# EasyEDA Pro project WEN-OP-AD8367可变增益放大器.epro

# Schematic Schematic2
Board Name: WEN-OP-AD8367可变增益放大器; Create Date: 2025-03-23; Page Name: P1; Project Name: 2025电赛预制模块mmkk; Schematic Name: Schematic2; Update Date: 2025-03-24; Company: 嘉立创EDA; Page Size: A1; Version: V1.0
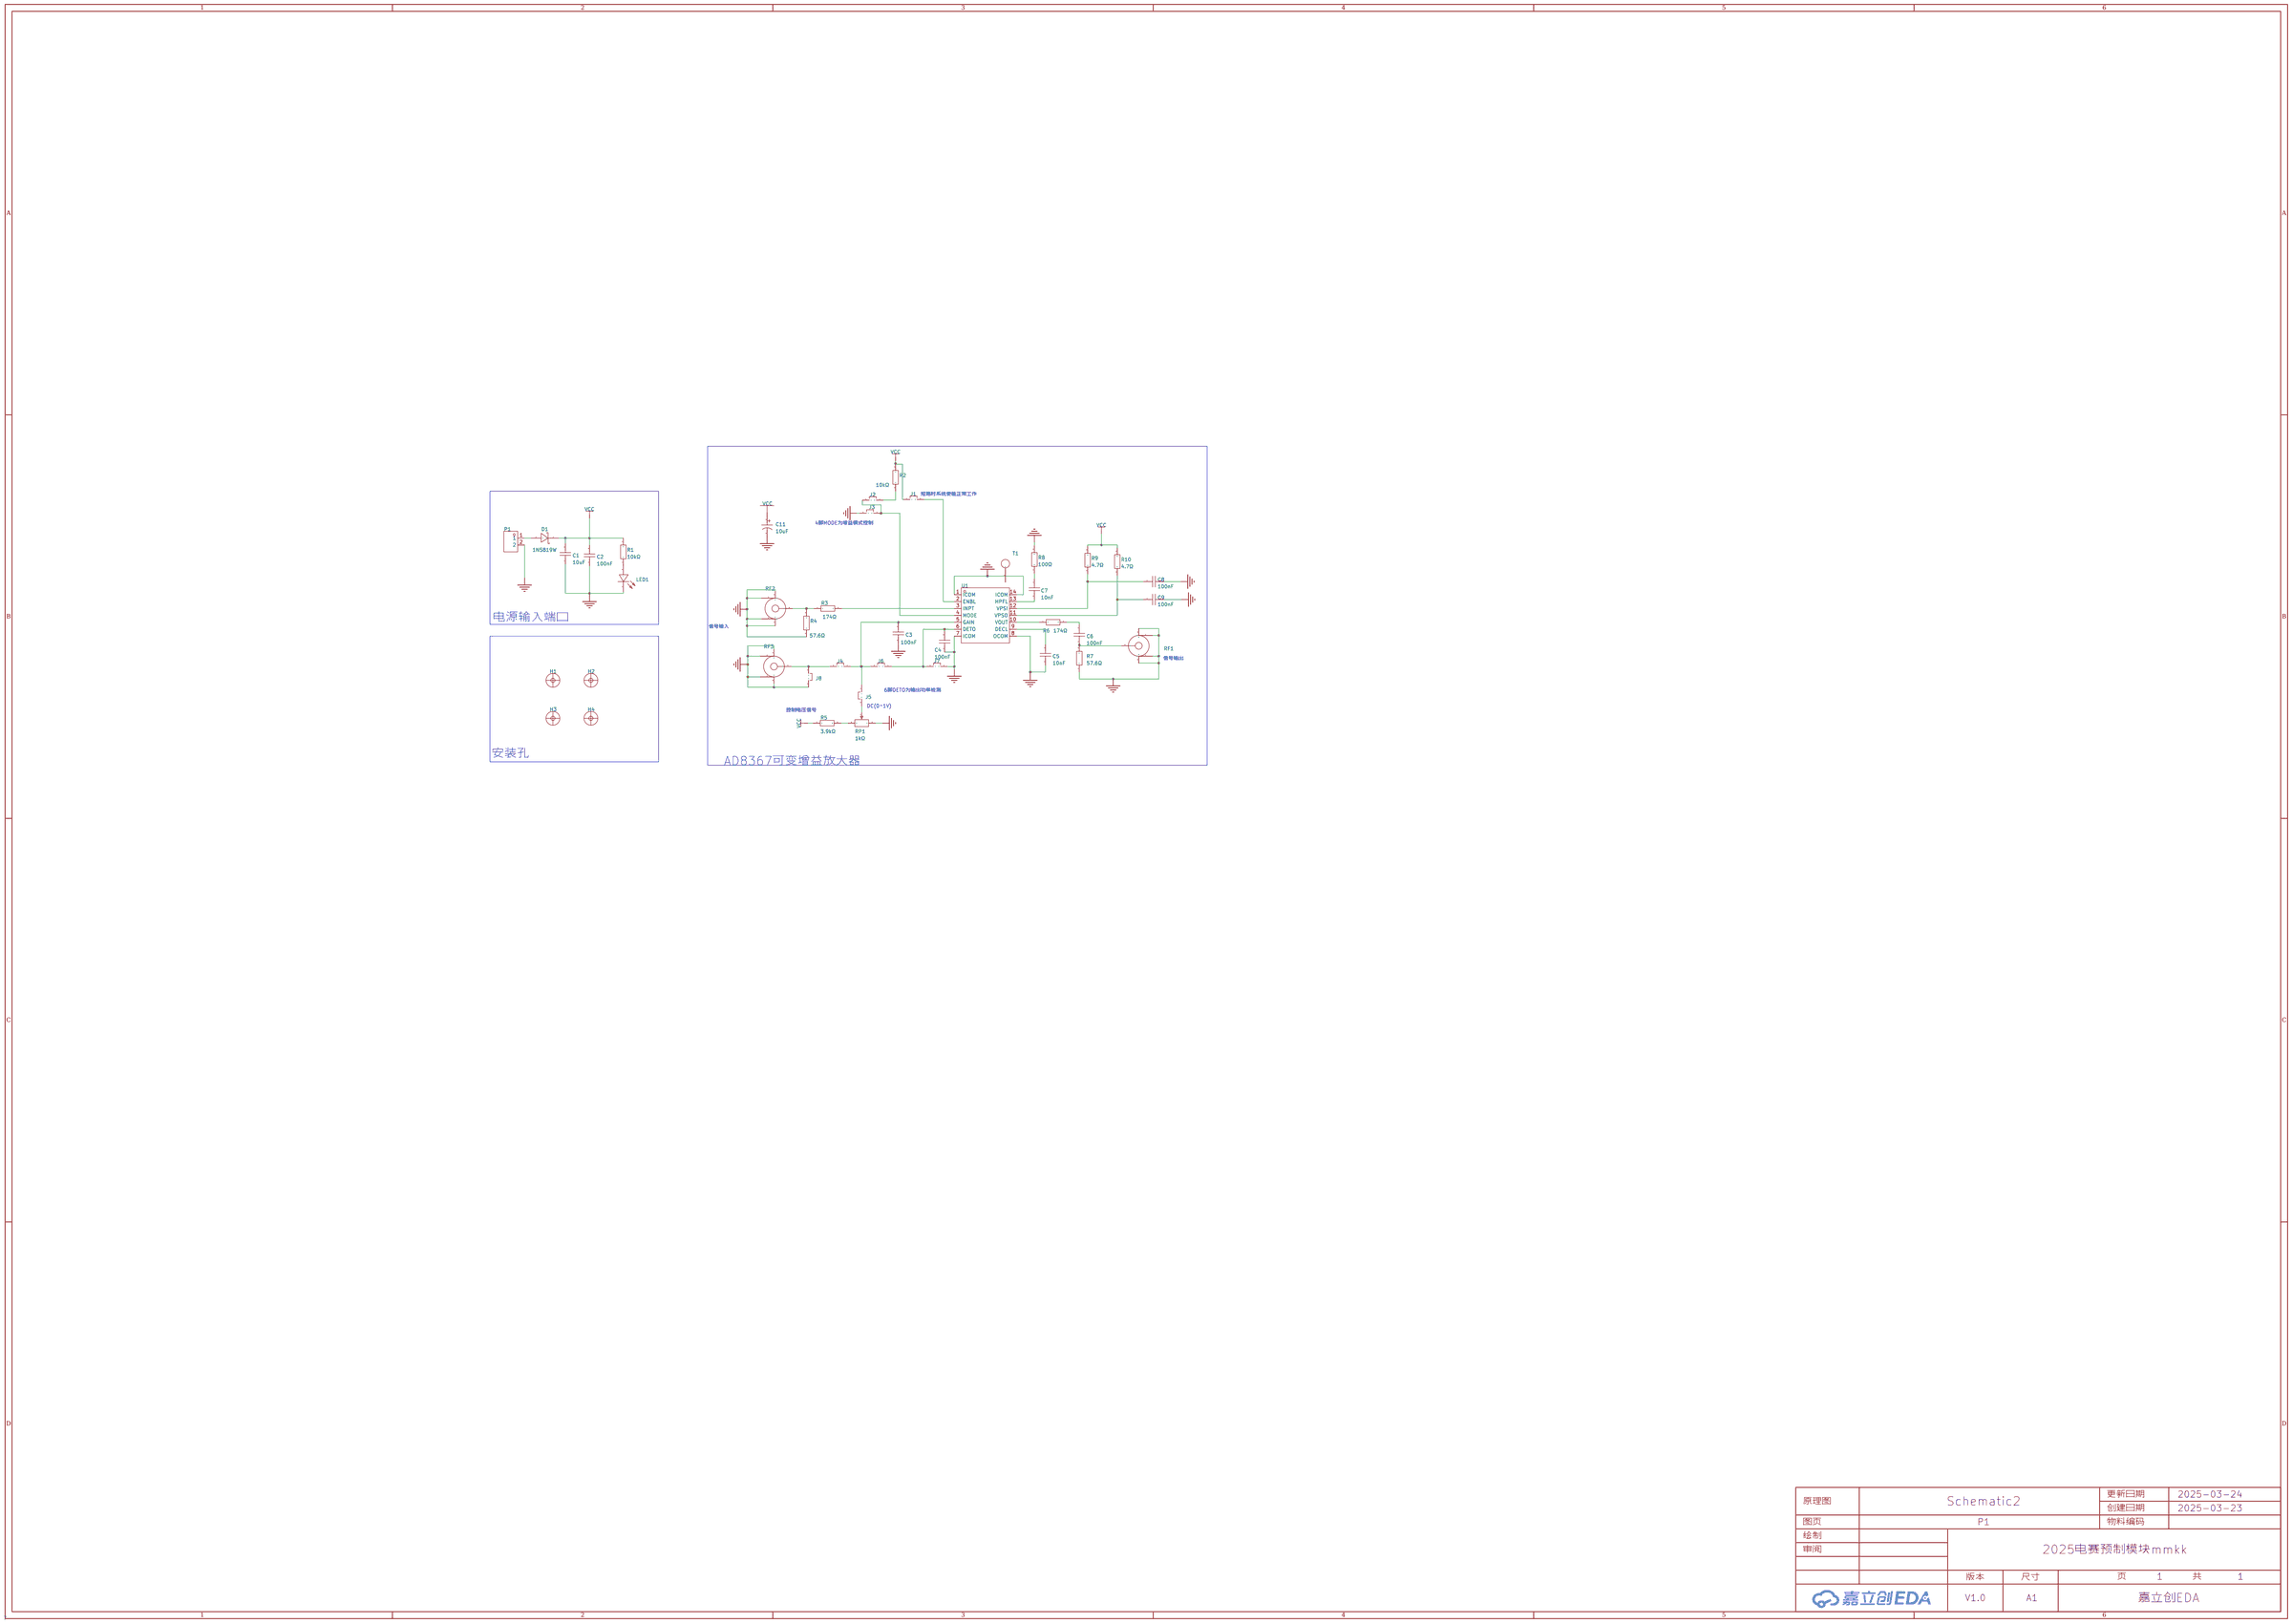
[diagram p0: schematic sheet]

## Parts
C1  10uF  [C0805]
C2  100nF  [C0805]
C3  100nF  [C0805]
C4  100nF  [C0805]
C5  10nF  [C0805]
C6  100nF  [C0805]
C7  10nF  [C0805]
C8  100nF  [C0805]
C9  100nF  [C0805]
C11  10uF  [CAP-SMD_BD4.0-L4.3-W4.3-FD]
D1  1N5819W  [SOD-323F_L2.5-W1.3-RD]
H1  -  [M3]
H2  -  [M3]
H3  -  [M3]
H4  -  [M3]
J1  PZ254V-11-02P  [HDR-TH_2P-P2.54-V-M]
J2  PZ254V-11-02P  [HDR-TH_2P-P2.54-V-M]
J3  PZ254V-11-02P  [HDR-TH_2P-P2.54-V-M]
J4  PZ254V-11-02P  [HDR-TH_2P-P2.54-V-M]
J5  PZ254V-11-02P  [HDR-TH_2P-P2.54-V-M]
J6  PZ254V-11-02P  [HDR-TH_2P-P2.54-V-M]
J7  PZ254V-11-02P  [HDR-TH_2P-P2.54-V-M]
J8  PZ254V-11-02P  [HDR-TH_2P-P2.54-V-M]
LED1  NCD0805R1  [LED0805-RD_RED]
P1  KF301-5.0-2P  [CONN-TH_P5.00_KF301-5.0-2P]
R1  10kΩ  [R0805]
R2  10kΩ  [R0805]
R3  174Ω  [R0805]
R4  57.6Ω  [R0805]
R5  3.9kΩ  [R0805]
R6  174Ω  [R0805]
R7  57.6Ω  [R0805]
R8  100Ω  [R0805]
R9  4.7Ω  [R0805]
R10  4.7Ω  [R0805]
RF1  BWSMA-KE-P001  [SMA-SMD_BWSMA-KE-P001]
RF2  BWSMA-KE-P001  [SMA-SMD_BWSMA-KE-P001]
RF3  BWSMA-KE-P001  [SMA-SMD_BWSMA-KE-P001]
RP1  1kΩ  [RES-ADJ-TH_3P-L10.0-W10.0-P2.50-BL-BS]
T1  -  [测试环]
U1  AD8367ARUZ-RL7  [TSSOP-14_L5.0-W4.4-P0.65-LS6.4-BL]

## Library data of the parts
C1 = CL21A106KAYNNNE_C15850: 容值:10uF;精度:±10%;额定电压:25V;材质(温度系数):X5R;; LCSC Part Name: 10uF ±10% 25V; Supplier Part: C15850; Manufacturer: SAMSUNG(三星); Manufacturer Part: CL21A106KAYNNNE; Supplier Footprint: 0805; JLCPCB Part Class: 基础库; Datasheet: https://atta.szlcsc.com/upload/public/pdf/source/20160103/1457707679302.pdf; Supplier: LCSC; Tolerance: ±10%; Voltage Rated: 25V; Temperature Coefficient: X5R
C2-C4 C6 C8 C9 = CL21B104KCFNNNE: 容值:100nF;精度:±10%;额定电压:100V;材质(温度系数):X7R;; LCSC Part Name: 100nF ±10% 100V; Supplier Part: C28233; Manufacturer: SAMSUNG(三星); Supplier Footprint: 0805; JLCPCB Part Class: Basic Part; Datasheet: https://atta.szlcsc.com/upload/public/pdf/source/20160103/1457707716102.pdf; Supplier: LCSC; Tolerance: ±10%; Voltage Rated: 100V; Temperature Coefficient: X7R
C5 C7 = CL21B103KBANNNC: 容值:10nF;精度:±10%;额定电压:50V;材质(温度系数):X7R;; LCSC Part Name: 10nF ±10% 50V; Supplier Part: C1710; Manufacturer: SAMSUNG(三星); Supplier Footprint: 0805; JLCPCB Part Class: Basic Part; Datasheet: https://atta.szlcsc.com/upload/public/pdf/source/20160103/1457707693082.pdf; Supplier: LCSC; Tolerance: ±10%; Voltage Rated: 50V; Temperature Coefficient: X7R
C11 = CS1C100M-CRC54: 容值:10uF;精度:±20%;额定电压:16V;电容体直径:4mm;电容体长度:5.4mm;纹波电流:-;等效串联电阻:-;工作寿命:1000hrs@105℃;工作温度:-40℃~+105℃;; LCSC Part Name: 10uF ±20% 16V; Supplier Part: C116085; Manufacturer: ST(先科); Supplier Footprint: SMD,D4xL5.4mm; JLCPCB Part Class: Extended Part; Datasheet: https://atta.szlcsc.com/upload/public/pdf/source/20170705/1499242712395.pdf; Supplier: LCSC; Tolerance: ±20%; Rated Voltage: 16V; φD: 4mm; L: 5.4mm; Lifetime @ Temp: 1000hrs@105℃; Operating Temperature: -40℃~+105℃
D1 = 1N5819W_C169540: 直流反向耐压(Vr):40V;平均整流电流(Io):1A;正向压降(Vf):600mV@1A;; LCSC Part Name: 40V 1A 600mV@1A; Supplier Part: C169540; Manufacturer: 晶导微电子; Supplier Footprint: SOD-123F; JLCPCB Part Class: Extended Part; Datasheet: https://atta.szlcsc.com/upload/public/pdf/source/20180316/CADAC6127F7EB1C6F7CC209B8BEF97B8.pdf; Supplier: LCSC; Reverse Voltage (Vr): 40V; Average Rectified Current (Io): 1A; Forward Voltage (Vf@If): 600mV@1A
H1-H4 = M3: Manufacturer: Shuntian(顺天五金); Manufacturer Part: M3x10+6; Supplier Part: C551322; Supplier: LCSC; JLCPCB Part Class: 扩展库
J1-J8 = PZ254V-11-02P: 排数:单排;总PIN位数:2;间距:2.54mm;插针结构:1x2P;行距:-;安装类型:直插;圆针/方针:方针;额定电流:-;额定电压:-;配合针长度:6mm;塑高:2.5mm;端接针长度:3mm;触头材质:黄铜;触头镀层:-;工作温度范围:-40℃~+105℃;颜色:黑色;; LCSC Part Name: 2.54mm 1x2P 直插 方针; Supplier Part: C492401; Manufacturer: XFCN(兴飞); Supplier Footprint: 直插,P=2.54mm; JLCPCB Part Class: Extended Part; Datasheet: https://atta.szlcsc.com/upload/public/pdf/source/20200309/C492401_A812433581A9B211A7FFA413ADDFF0E5.pdf; Supplier: LCSC; Number of Rows: 单排; Number of Pins: 2; Pitch: 2.54mm; Pin Structure: 1x2P; Mounting Type: 直插; Circluar Pins/Square Pins: 方针; Length of Mating Pin: 6mm; Insulation Height: 2.5mm; Length of End Connection Pin: 3mm; Contact Material: 黄铜; Operating Temperature Range: -40℃~+105℃; Color: 黑色
LED1 = NCD0805R1: 发光颜色:红灯;; LCSC Part Name: 红灯; Supplier Part: C84256; Manufacturer: 国星光电; Supplier Footprint: 0805; JLCPCB Part Class: Basic Part; Datasheet: https://atta.szlcsc.com/upload/public/pdf/source/20200820/C84256_F0A75A43B3EAD75808600A0514C76B99.pdf; Supplier: LCSC; Emitted Color: 红灯
P1 = KF301-5.0-2P: 间距:5mm;排数:1;每排PIN数:2;安装方式:直针;额定电流:17A;额定电压:250V;线规 - AWG:14~22;线规 - mm?:1.5;工作温度范围:-30℃~+120℃;颜色:蓝色;; LCSC Part Name: 5mm 排数:1 每排P数:2 直针 可拼接 铜 环保; Supplier Part: C474881; Manufacturer: KEFA(科发); Supplier Footprint: 直插,P=5mm; JLCPCB Part Class: 扩展库; Datasheet: https://atta.szlcsc.com/upload/public/pdf/source/20200115/C474881_883EFE2003339C40FD1BEEEFC9A18423.pdf; Supplier: LCSC; Pitch: 5mm; Number of Rows: 1; Number of PINs Per Row: 2; Mounting Style: 直针; Current Rating (Max): 17A; Voltage Rating (Max): 250V; Wire Gauge - AWG: 14~22; Wire Gauge - mm?: 1.5; Operating Temperature Range: -30℃~+120℃; Color: 蓝色
R1 R2 = 0805W8F1002T5E_C17414: 电阻类型:厚膜电阻;阻值:10kΩ;精度:±1%;功率:125mW;; LCSC Part Name: 10kΩ ±1% 125mW; Supplier Part: C17414; Manufacturer: UNI-ROYAL(厚声); Manufacturer Part: 0805W8F1002T5E; Supplier Footprint: 0805; JLCPCB Part Class: Basic Part; Datasheet: https://atta.szlcsc.com/upload/public/pdf/source/20200306/C422600_1E6D84923E4A46A82E41ADD87F860B5C.pdf; Supplier: LCSC; Type: 厚膜电阻; Tolerance: ±1%; Power(Watts): 125mW; Temperature Coefficient: ±100ppm/℃; Overload Voltage (Max): 150V; Operating Temperature Range: -55℃~+155℃
R3 R6 = 0805W8F1740T5E: 电阻类型:厚膜电阻;阻值:174Ω;精度:±1%;功率:125mW;; LCSC Part Name: 174Ω ±1% 125mW; Supplier Part: C17494; Manufacturer: UNI-ROYAL(厚声); Supplier Footprint: 0805; JLCPCB Part Class: Extended Part; Datasheet: https://atta.szlcsc.com/upload/public/pdf/source/20200306/C422600_1E6D84923E4A46A82E41ADD87F860B5C.pdf; Supplier: LCSC; Type: 厚膜电阻; Tolerance: ±1%; Power(Watts): 125mW; Temperature Coefficient: ±100ppm/℃; Overload Voltage (Max): 150V; Operating Temperature Range: -55℃~+155℃
R4 R7 = 0805W8F576JT5E: 电阻类型:厚膜电阻;阻值:57.6Ω;精度:±1%;功率:125mW;; LCSC Part Name: 57.6Ω ±1% 125mW; Supplier Part: C17759; Manufacturer: UNI-ROYAL(厚声); Supplier Footprint: 0805; JLCPCB Part Class: Extended Part; Datasheet: https://atta.szlcsc.com/upload/public/pdf/source/20200306/C422600_1E6D84923E4A46A82E41ADD87F860B5C.pdf; Supplier: LCSC; Type: 厚膜电阻; Tolerance: ±1%; Power(Watts): 125mW; Temperature Coefficient: ±100ppm/℃; Overload Voltage (Max): 150V; Operating Temperature Range: -55℃~+155℃
R5 = 0805W8F3901T5E: 电阻类型:厚膜电阻;阻值:3.9kΩ;精度:±1%;功率:125mW;; LCSC Part Name: 3.9kΩ ±1% 125mW; Supplier Part: C17614; Manufacturer: UNI-ROYAL(厚声); Supplier Footprint: 0805; JLCPCB Part Class: Basic Part; Datasheet: https://atta.szlcsc.com/upload/public/pdf/source/20200306/C422600_1E6D84923E4A46A82E41ADD87F860B5C.pdf; Supplier: LCSC; Type: 厚膜电阻; Tolerance: ±1%; Power(Watts): 125mW; Temperature Coefficient: ±100ppm/℃; Overload Voltage (Max): 150V; Operating Temperature Range: -55℃~+155℃
R8 = 0805W8F1000T5E: 电阻类型:厚膜电阻;阻值:100Ω;精度:±1%;功率:125mW;; LCSC Part Name: 100Ω ±1% 125mW; Supplier Part: C17408; Manufacturer: UNI-ROYAL(厚声); Supplier Footprint: 0805; JLCPCB Part Class: Basic Part; Datasheet: https://atta.szlcsc.com/upload/public/pdf/source/20200306/C422600_1E6D84923E4A46A82E41ADD87F860B5C.pdf; Supplier: LCSC; Type: 厚膜电阻; Tolerance: ±1%; Power(Watts): 125mW; Temperature Coefficient: ±100ppm/℃; Overload Voltage (Max): 150V; Operating Temperature Range: -55℃~+155℃
R9 R10 = 0805W8F470KT5E: 电阻类型:厚膜电阻;阻值:4.7Ω;精度:±1%;功率:125mW;; LCSC Part Name: 4.7Ω ±1% 125mW; Supplier Part: C17675; Manufacturer: UNI-ROYAL(厚声); Supplier Footprint: 0805; JLCPCB Part Class: Basic Part; Datasheet: https://atta.szlcsc.com/upload/public/pdf/source/20200306/C422600_1E6D84923E4A46A82E41ADD87F860B5C.pdf; Supplier: LCSC; Type: 厚膜电阻; Tolerance: ±1%; Power(Watts): 125mW; Temperature Coefficient: ±200ppm/℃; Overload Voltage (Max): 150V; Operating Temperature Range: -55℃~+155℃
RF1-RF3 = BWSMA-KE-P001: 连接器类型:板端;射频系列:SMA;接口类型:内孔;端口数量:1;阻抗:50Ω;频率-最大值:12.4GHz;样式:偏脚;接口直径:5.2mm;接口长度/高度:-;工作温度范围:-;; LCSC Part Name: SMA 内孔 偏脚 SMA偏脚板端座子; Supplier Part: C496550; Manufacturer: BAT WIRELESS(蝙蝠无线); Supplier Footprint: 插件; JLCPCB Part Class: Extended Part; Datasheet: https://atta.szlcsc.com/upload/public/pdf/source/20200416/C496550_06668BF2E3B968EA39F96D17E7156373.pdf; Supplier: LCSC; Connector Type: 板端; RF Series: SMA; Interface Type: 内孔; Number of Ports: 1; Impedance: 50Ω; Frequency-Max: 12.4GHz; Style: 偏脚; Interface Diameter: 5.2mm
RP1 = 3296W-1-102: 阻值:1kΩ;精度:±10%;; LCSC Part Name: 1kΩ ±10%; Supplier Part: C118949; Manufacturer: BOCHEN(博晨); Supplier Footprint: 插件; JLCPCB Part Class: Extended Part; Datasheet: https://atta.szlcsc.com/upload/public/pdf/source/20171114/C118949_15106326635991117438.pdf; Supplier: LCSC; Tolerance: ±10%
T1 = 测试环
U1 = AD8367ARUZ-RL7: Supplier Part: C191561; Manufacturer: ADI(亚德诺)/LINEAR(凌特); Supplier Footprint: TSSOP-14; JLCPCB Part Class: Extended Part; Datasheet: https://atta.szlcsc.com/upload/public/pdf/source/20200408/C191561_25904AF254F64640D2A0ECFC6C3DB0D9.pdf; Supplier: LCSC

## Nets
GND: C1.1 C2.1 C3.1 C4.1 C5.1 C8.1 C9.1 C11.2 J3.2 J7.1 J8.1 LED1.1(-) P1.2 R4.1 R7.1 R8.2 RF1.1 RF1.2 RF1.3 RF1.4 RF2.1 RF2.2 RF2.3 RF2.4 RF3.1 RF3.2 RF3.3 RF3.4 RP1.1 U1.1(ICOM) U1.7(ICOM) U1.8(OCOM) U1.14(ICOM)
VCC: C1.2 C2.2 C11.1 D1.1 J1.1 R1.2 R2.2 R5.1 R9.2 R10.2
$1N1825: C6.1 R7.2 RF1.5
$1N1943: D1.2 P1.1
$1N1990: LED1.2(+) R1.1
$1N2089: R3.1 R4.2 RF2.5
$1N2221: J2.2 J3.1 U1.4(MODE)
$1N2225: J1.2 U1.2(ENBL)
$1N2372: J2.1 R2.1
$1N2445: R3.2 U1.3(INPT)
$1N2449: C3.2 J4.1 J5.1 J6.2 U1.5(GAIN)
$1N2502: C4.2 J6.1 J7.2 U1.6(DETO)
$1N2615: R5.2 RP1.3
$1N2619: J5.2 RP1.2
$1N2657: J4.2 J8.2 RF3.5
$1N2792: C5.2 U1.9(DECL)
$1N2797: R6.1 U1.10(VOUT)
$1N2803: C6.2 R6.2
$1N2932: C7.2 U1.13(HPFL)
$1N2935: C7.1 R8.1
$1N2952: C8.2 R9.1 U1.12(VPSI)
$1N2960: C9.2 R10.1 U1.11(VPSO)

Not connected (* = marked no-connect by the designer): T1 1

## Notes on the sheet
- 短路时系统使能正常工作
- 4脚MODE为增益模式控制
- 电源输入端口
- 信号输入
- 信号输出
- 6脚DETO为输出功率检测
- 控制电压信号
- DC(0～1V)
- 安装孔
- AD8367可变增益放大器

# Board PCB3
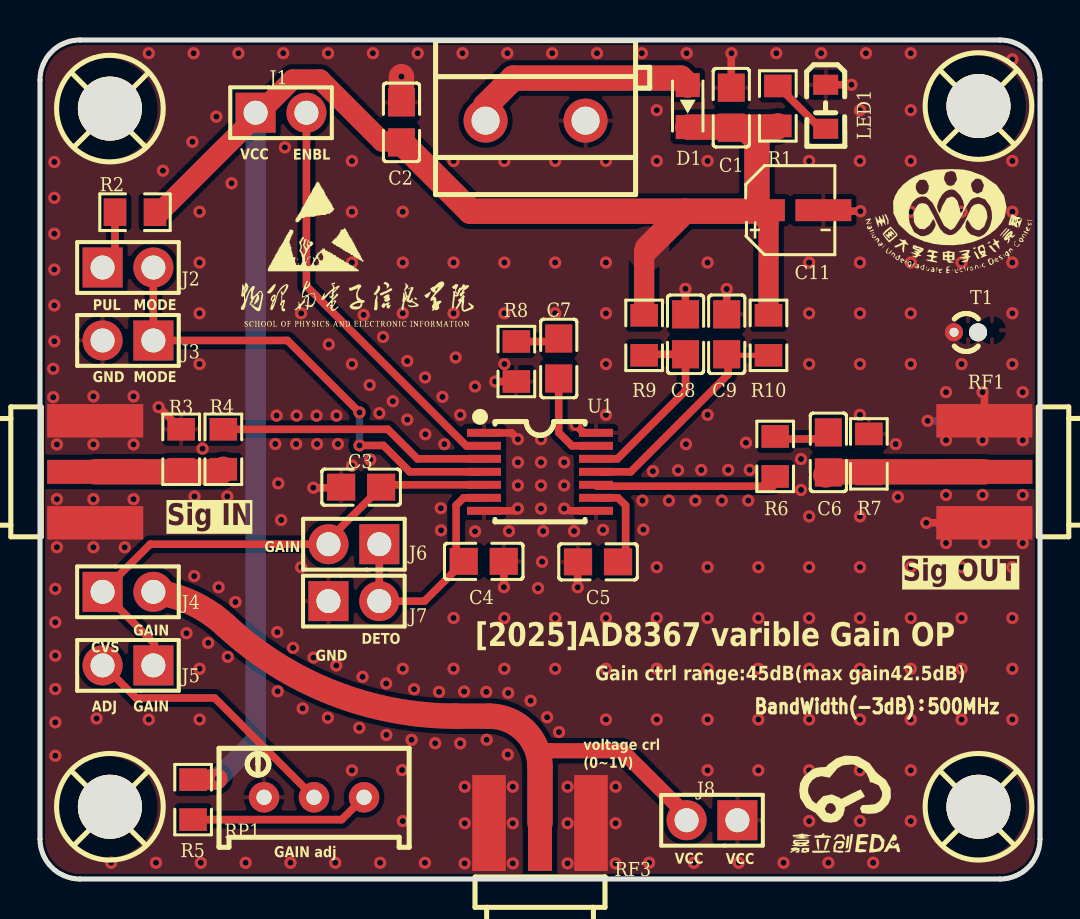
[diagram p1: board, top side]
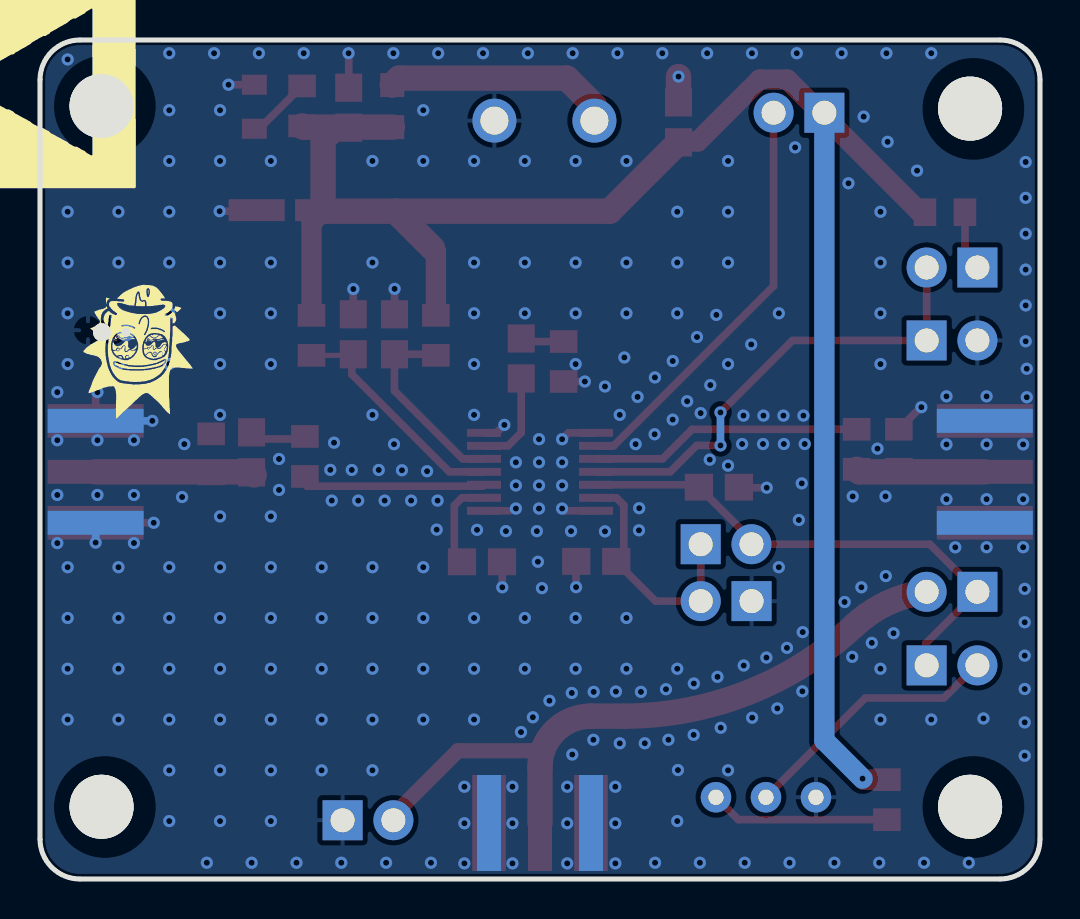
[diagram p2: board, bottom side, seen from below]

Outline 50 x 41.97 mm; copper layers: Top Layer, Bottom Layer. Coordinates in mm from the lower left corner of the outline.
Outline path: 0,39.97 0,2 arc(0.59,0.59) 2,0 48,0 arc(49.41,0.59) 50,2 50,39.97 arc(49.41,41.38) 48,41.97 2,41.97 arc(0.59,41.38) 0,39.97
Stack: Top Layer 0.035mm / Dielectric1 1.51mm FR4 er 4.5 / Bottom Layer 0.035mm

## Design rules (mm)
template: 自定义配置
spacing copperThickness1oz (default): track to track 0.102, other pairs 0.152 to 0.3
spacing copperThickness2oz: track to track 0.203, other pairs 0.152 to 0.3
track width copperThickness1oz: min 0.127, default 0.254, max 2.54
track width copperThickness2oz: min 0.203, default 0.254, max 2.54
track width trackWidth1 (default): min 0.127, default 0.381, max 2.54
differential pair differentialPair (default): width min 0.127, default 0.254, max 2.54; gap min 0.152, default 0.152
via viaSize (default): diameter min 0.5, default 0.61, max 10; hole min 0.3, default 0.305, max 6.299
region e2454 uses RFconect
region e2577 uses RFconect
region e2578 uses RFconect

## Placement (name value [footprint] x y rotation side)
C1  10uF  [C0805]  34.56 38.58 270 top
C2  100nF  [C0805]  18.07 37.85 270 top
C3  100nF  [C0805]  16.06 19.6 0 top
C4  100nF  [C0805]  22.19 15.89 180 top
C5  10nF  [C0805]  27.9 15.87 0 top
C6  100nF  [C0805]  39.42 21.34 90 top
C7  10nF  [C0805]  25.94 26.04 270 top
C8  100nF  [C0805]  32.28 27.25 270 top
C9  100nF  [C0805]  34.34 27.25 270 top
C11  10uF  [CAP-SMD_BD4.0-L4.3-W4.3-FD]  37.51 33.46 0 top
D1  1N5819W  [SOD-323F_L2.5-W1.3-RD]  32.39 38.66 90 top
H1  -  [M3]  3.33 38.53 0 top
H2  -  [M3]  46.76 38.65 0 top
H3  -  [M3]  46.76 3.6 0 top
H4  -  [M3]  3.33 3.6 0 top
J1  PZ254V-11-02P  [HDR-TH_2P-P2.54-V-M]  12.05 38.33 0 top
J2  PZ254V-11-02P  [HDR-TH_2P-P2.54-V-M]  4.4 30.59 0 top
J3  PZ254V-11-02P  [HDR-TH_2P-P2.54-V-M]  4.4 26.94 180 top
J4  PZ254V-11-02P  [HDR-TH_2P-P2.54-V-M]  4.4 14.37 0 top
J5  PZ254V-11-02P  [HDR-TH_2P-P2.54-V-M]  4.4 10.69 180 top
J6  PZ254V-11-02P  [HDR-TH_2P-P2.54-V-M]  15.7 16.75 180 top
J7  PZ254V-11-02P  [HDR-TH_2P-P2.54-V-M]  15.69 13.9 0 top
J8  PZ254V-11-02P  [HDR-TH_2P-P2.54-V-M]  33.6 2.94 180 top
LED1  NCD0805R1  [LED0805-RD_RED]  39.28 38.63 270 top
P1  KF301-5.0-2P  [CONN-TH_P5.00_KF301-5.0-2P]  24.78 37.94 0 top
R1  10kΩ  [R0805]  36.89 38.67 270 top
R2  10kΩ  [R0805]  4.75 33.36 0 top
R3  174Ω  [R0805]  9.17 21.5 90 top
R4  57.6Ω  [R0805]  7.06 21.5 270 top
R5  3.9kΩ  [R0805]  7.65 3.97 270 top
R6  174Ω  [R0805]  36.76 21.14 90 top
R7  57.6Ω  [R0805]  41.44 21.27 270 top
R8  100Ω  [R0805]  23.82 25.89 270 top
R9  4.7Ω  [R0805]  30.21 27.2 90 top
R10  4.7Ω  [R0805]  36.43 27.2 90 top
RF1  BWSMA-KE-P001  [SMA-SMD_BWSMA-KE-P001]  47.22 20.37 0 top
RF2  BWSMA-KE-P001  [SMA-SMD_BWSMA-KE-P001]  2.76 20.37 180 top
RF3  BWSMA-KE-P001  [SMA-SMD_BWSMA-KE-P001]  25 2.8 270 top
RP1  1kΩ  [RES-ADJ-TH_3P-L10.0-W10.0-P2.50-BL-BS]  13.7 4.09 90 top
T1  -  [测试环]  47 27.4 180 top
U1  AD8367ARUZ-RL7  [TSSOP-14_L5.0-W4.4-P0.65-LS6.4-BL]  25 20.37 270 top

## Footprints (pads in the part's own frame, mm; a bottom-side part is the same pattern mirrored in y, then rotated)
C0805
  rect 1.41x1.35 smd: 1(-1,0) 2(1,0)
CAP-SMD_BD4.0-L4.3-W4.3-FD
  rect 2.8x1.1 smd: 1(-1.661,0) 2(1.661,0)
CONN-TH_P5.00_KF301-5.0-2P
  round 2.2 hole 1.4: 1(-2.5,0) 2(2.5,0)
HDR-TH_2P-P2.54-V-M
  rect 2x2 hole 1.2: 1(-1.27,0)
  round 2 hole 1.2: 2(1.27,0)
LED0805-RD_RED
  rect 1x1.25 smd: 1(-1.1,0) 2(1.1,0)
M3
  round 3.2 hole 3.2: 1(0.165,0.013)
R0805
  rect 1.133x1.377 smd: 1(-1,0) 2(1,0)
RES-ADJ-TH_3P-L10.0-W10.0-P2.50-BL-BS
  round 1.524 hole 0.762: 1(0,2.5) 2(0,0) 3(0,-2.5)
SMA-SMD_BWSMA-KE-P001
  rect 4.8x1.677 smd: 1(0,-2.55) 2(0,2.55)
  rect 4.8x1.2 smd far side: 3(0,2.55) 4(0,-2.55)
  rect 4.8x1.2 smd: 5(0,0)
SOD-323F_L2.5-W1.3-RD
  rect 1.2x1.2 smd: 1(-1.05,0) 2(1.05,0)
TSSOP-14_L5.0-W4.4-P0.65-LS6.4-BL
  rect 0.4x1.7 smd: 1(-1.95,-2.8) 2(-1.3,-2.8) 3(-0.65,-2.8) 4(0,-2.8) 5(0.65,-2.8) 6(1.3,-2.8) 7(1.95,-2.8) 8(1.95,2.8) 9(1.3,2.8) 10(0.65,2.8) 11(0,2.8) 12(-0.65,2.8) 13(-1.3,2.8) 14(-1.95,2.8)
测试环
  round 0.9 hole 0.914x0.45: 1(0.103,0.051)
  round 0.9 hole 0.45: 1(1.304,0.051)

## Nets
As in the schematic, except:
GND: C1.1 C2.1 C3.1 C4.1 C5.1 C8.1 C9.1 C11.2 J3.2 J7.1 J8.1 LED1.1 P1.2 R4.1 R7.1 R8.2 RF1.1 RF1.2 RF1.3 RF1.4 RF2.1 RF2.2 RF2.3 RF2.4 RF3.1 RF3.2 RF3.3 RF3.4 RP1.1 T1.1 U1.1 U1.7 U1.8 U1.14

Pads without a net: H1 1; H2 1; H3 1; H4 1

## Via types
v1: diameter 0.61, hole 0.305, Top Layer to Bottom Layer, 316 vias

## Routing (per net, layer and track width the routed paths; a pad name or vN(x,y) marks a point on that pad's centre or on a via; arc(x,y) is an arc through that point)
GND: length 29.3
  Top Layer w0.381: v1(5.93,23.6) 5.95,23.6 R4.1 ; C5.1 26.89,15.85 v1(26.89,14.59) ; v1(26.78,22.72) 27.18,22.32 U1.14 ; U1.8 26.48,18.42 ; U1.1 23.58,22.32 v1(23.89,22) ; R8.2 v1(22.76,24.89) ; RF1.2 47.22,24.31 ; C8.1 32.27,28.25 v1(32.27,29.52) ; U1.7 23.78,18.42 v1(23.89,18.53) ; C3.1 15.03,19.57 v1(13.66,19.57) ; RF1.1 v1(44.31,17.82) ; C4.1 23.2,15.88 v1(23.2,14.6) ; C9.1 v1(34.34,29.51) ; 39.17,33.41 v1(41.02,33.41) ; C1.1 34.56,41.07 ; LED1.1 v1(40.57,39.73)
  Top Layer w1.27: C2.1 v1(18.07,40.14)
  Bottom Layer w0.381: RF1.2 v1(44.38,22.92) ; RF1.1 v1(47.22,16.83)
  vias: v1(0.72,35.87) v1(0.72,34.07) v1(0.72,32.28) v1(0.72,30.49) v1(0.72,28.69) v1(0.72,26.9) v1(0.66,25.52) v1(0.66,24.1) v1(0.84,21.74) v1(0.84,19) v1(0.84,16.6) v1(0.77,14.51) v1(0.77,12.84) v1(0.77,11.17) v1(0.77,9.5) v1(0.77,7.84) v1(0.77,6.17) v1(2.67,24.14) v1(2.67,21.74) v1(2.67,19) v1(2.67,16.6) v1(2.83,8.03) v1(3.56,0.81) v1(4.24,16.59) v1(4.68,24.14) v1(4.68,21.74) v1(4.68,19) v1(5.44,41.31) v1(5.44,7.98) v1(5.8,0.81) v1(6.15,35.43) v1(7.32,12.29) v1(7.62,36.88) v1(7.68,41.31) v1(7.73,19.14) v1(7.71,15.15) v1(7.98,33.38) v1(7.98,30.84) v1(7.98,28.3) v1(7.98,25.76) v1(7.98,10.52) v1(7.98,7.98) v1(8.04,0.81) v1(8.13,21.53) v1(8.41,11.81) v1(8.82,38.14) v1(8.93,14.59) v1(9.37,19.14) v1(9.39,11.11) v1(9.58,34.8) v1(9.77,13.86) v1(9.92,41.31) v1(10.28,0.81) v1(11.83,23.18) v1(11.76,21.76) v1(11.91,19.79) v1(11.86,12.35) v1(11.88,9.39) v1(12.06,17.96) v1(12.16,41.31) v1(12.24,36.6) v1(12.52,0.81) v1(12.65,11.56) v1(12.83,23.18) v1(12.81,21.76) v1(13.06,28.3) v1(13.06,15.6) v1(13.13,8.53) v1(13.68,11.08) v1(13.83,23.18) v1(13.85,21.76) v1(14.4,41.31) v1(14.44,26.74) v1(14.39,8.07) v1(14.83,23.18) v1(14.81,10.68) v1(14.76,0.81) v1(14.9,21.76) v1(15.6,35.92) v1(15.6,33.38) v1(15.6,30.84) v1(15.6,25.76) v1(15.6,20.68) v1(15.6,5.44) v1(15.97,7.57) v1(16.13,10.11) v1(16.18,28.22) v1(16.48,24.71) v1(16.51,20.98) v1(16.64,41.31) v1(16.97,23.31) v1(17.01,0.81) v1(17.15,27.11) v1(17.31,9.78) v1(17.32,7.21) v1(17.64,23.9) v1(18.14,33.38) v1(18.14,30.84) v1(18.14,28.3) v1(18.14,10.52) v1(18.1,5.45) v1(18.14,2.9) v1(18.36,25.91) v1(18.37,22.98) v1(18.58,6.97) v1(18.7,9.49) v1(18.88,41.31) v1(19.25,0.81) v1(19.25,25.09) v1(19.27,22.25) v1(19.76,6.79) v1(20.04,18.55) v1(19.95,9.36) v1(20.12,24.12) v1(20.05,17.44) v1(20.22,21.75) v1(20.68,35.92) v1(20.68,30.84) v1(20.68,28.3) v1(20.68,13.06) v1(20.68,10.52) v1(20.78,26.09) v1(21.01,23.22) v1(21.01,6.79) v1(21.13,41.31) v1(21.2,9.38) v1(21.24,4.62) v1(21.24,2.79) v1(21.23,0.78) v1(21.75,24.64) v1(21.75,17.39) v1(22.31,9.36) v1(22.33,6.97) v1(23.22,35.92) v1(23.22,30.84) v1(23.22,28.3) v1(23.22,25.76) v1(23.22,13.06) v1(23.22,10.52) v1(23.37,41.31) v1(23.45,17.4) v1(23.41,9.31) v1(23.39,6.23) v1(23.64,4.62) v1(23.64,2.79) v1(23.64,0.78) v1(23.89,20.84) v1(23.89,19.69) v1(24.53,8.92) v1(24.9,14.55) v1(25.05,22) v1(25.05,20.84) v1(25.05,19.69) v1(25.05,18.53) v1(25.11,15.87) v1(25.16,17.4) v1(25.36,8.09) v1(25.61,41.31) v1(25.76,35.92) v1(25.76,30.84) v1(25.76,28.3) v1(25.76,13.06) v1(25.76,10.52) v1(25.95,7.35) v1(26.21,20.84) v1(26.21,19.69) v1(26.21,18.53) v1(26.38,4.62) v1(26.38,2.79) v1(26.38,0.78) v1(26.7,17.4) v1(27.85,41.31) v1(28.15,17.47) v1(28.3,35.92) v1(28.3,30.84) v1(28.3,28.3) v1(28.3,25.76) v1(28.3,23.22) v1(28.3,13.06) v1(28.3,10.52) v1(28.3,7.98) v1(28.78,4.62) v1(28.78,2.79) v1(28.78,0.78) v1(30.09,41.31) v1(30.12,18.93) v1(30.17,17.48) v1(30.45,0.81) v1(30.65,20.4) v1(30.84,38.46) v1(30.84,35.92) v1(30.84,15.6) v1(30.84,13.06) v1(30.84,10.52) v1(30.84,7.98) v1(31.44,18.93) v1(31.9,20.45) v1(32.33,41.31) v1(32.3,21.75) v1(32.69,0.81) v1(32.77,18.93) v1(33.06,20.46) v1(33.38,35.92) v1(33.38,30.84) v1(33.38,23.22) v1(33.38,15.6) v1(33.38,13.06) v1(33.38,10.52) v1(33.38,7.98) v1(33.38,5.44) v1(34.09,18.93) v1(34.41,20.46) v1(34.57,41.31) v1(34.94,0.81) v1(35.3,21.83) v1(35.41,18.93) v1(35.49,20.47) v1(35.92,15.6) v1(35.92,13.06) v1(35.92,10.52) v1(35.92,7.98) v1(35.92,5.44) v1(36.81,41.31) v1(37.18,0.81) v1(38.05,21.01) v1(38.05,19.46) v1(38.46,35.92) v1(38.46,30.84) v1(38.46,28.3) v1(38.46,25.76) v1(38.46,18.14) v1(38.46,15.6) v1(38.46,13.06) v1(38.46,10.52) v1(38.46,7.98) v1(38.46,5.44) v1(38.46,2.9) v1(39.06,41.31) v1(39.42,0.81) v1(41,38.46) v1(41,35.92) v1(41,30.84) v1(41,28.3) v1(41,25.76) v1(41,23.22) v1(41,18.14) v1(41,15.6) v1(41,13.06) v1(41,10.52) v1(41,7.98) v1(41,5.44) v1(41,2.9) v1(41.3,41.31) v1(41.66,0.81) v1(42.79,21.76) v1(42.9,19.11) v1(43.54,41.31) v1(43.54,38.46) v1(43.54,35.92) v1(43.54,33.38) v1(43.54,30.84) v1(43.54,28.3) v1(43.54,25.76) v1(43.54,15.6) v1(43.54,13.06) v1(43.54,10.52) v1(43.54,7.98) v1(43.54,5.44) v1(43.54,2.9) v1(45.3,24.35) v1(45.3,21.95) v1(45.3,19.21) v1(45.3,16.81) v1(46.08,33.38) v1(46.08,30.84) v1(46.08,25.76) v1(46.08,15.6) v1(46.08,13.06) v1(46.08,10.52) v1(46.08,7.98) v1(47.13,24.35) v1(47.13,21.95) v1(47.13,19.21) v1(48.62,41) v1(48.62,35.92) v1(48.62,33.38) v1(48.62,30.84) v1(48.62,28.3) v1(48.62,25.76) v1(48.62,15.6) v1(48.62,13.06) v1(48.62,10.52) v1(48.62,7.98) v1(49.14,24.35) v1(49.14,21.95) v1(49.14,19.21) v1(49.14,16.8)
VCC: length 90.9
  Top Layer w1.016: 30.37,31.55 30.21,31.38 R9.2 ; 35.85,33.41 36.43,32.83 R10.2 ; v1(8.87,5.02) 8.82,4.97 R5.1 ; 18.03,36.9 17.1,36.9 14.01,39.99 12.63,39.99 6,33.36 R2.2
  Top Layer w1.27: D1.1 36.83,37.61 R1.2 ; 32.23,33.41 21.52,33.41 C2.2 ; 32.23,33.41 30.37,31.55 ; 32.23,33.41 35.85,33.41 35.85,36.98 35.5,37.32
  Bottom Layer w1.016: v1(8.87,5.02) 10.78,6.93 J1.1
$1N1825: length 8
  Top Layer w1.27: 39.29,20.21 39.44,20.37 RF1.5
$1N1943: length 11.6
  Top Layer w1.27: D1.2 32.04,40.06 23.66,40.06 22.28,38.68 P1.1
$1N1990: length 3.3
  Top Layer w0.381: LED1.2 39.03,37.53 R1.1
$1N2089: length 6.5
  Top Layer w1.27: R3.1 9.04,20.37 RF2.5
$1N2221: length 23.9
  Top Layer w0.381: v1(15.98,21.69) 17.17,21.69 18.49,20.37 U1.4 ; J2.2 J3.1 12.38,26.94 v1(15.98,23.34)
  Bottom Layer w0.381: v1(15.98,21.69) v1(15.98,23.34)
$1N2225: length 21.1
  Top Layer w0.381: 13.32,38.59 13.32,29.66 21.31,21.67 U1.2
$1N2372: length 3
  Top Layer w0.381: R2.1 3.75,31.21 J2.1
$1N2445: length 13.6
  Top Layer w0.381: U1.3 18.87,21.02 17.39,22.5 R3.2
$1N2449: length 26.2
  Top Layer w0.381: U1.5 17.17,19.72 C3.2 14.43,16.97 J6.2 5.51,16.75 J4.1 5.72,11.78 5.72,10.69
$1N2502: length 12.4
  Top Layer w0.381: J6.1 16.97,13.9 J7.2 19.22,13.9 21.19,15.87 20.81,16.25 20.81,18.69 21.18,19.07 U1.6
$1N2615: length 9
  Top Layer w0.381: RP1.3 15.08,2.97 R5.2
$1N2619: length 13.3
  Top Layer w0.381: RP1.2 8.74,9.06 4.81,9.06 3.17,10.69
$1N2657: length 34.6
  Top Layer w0.762: 25.47,6.42 25.22,6.17 ; 25.47,6.42 25.13,6.42 25,6.29 ; 25.47,6.42 29.1,6.42 32.6,2.92
  Top Layer w1.27: RF3.5 25,5.61 arc(24.26,7.4) 22.46,8.15 20.81,8.15 arc(14.61,9.32) 9.28,12.68 arc(8.99,12.94) 8.68,13.18 arc(7.25,13.97) J4.2
$1N2792: length 4.6
  Top Layer w0.381: U1.9 28.9,19.07 29.28,18.69 29.28,16.25 C5.2
$1N2797: length 9.6
  Top Layer w0.381: U1.10 27.87,19.65 36.65,19.65 37.14,20.14
$1N2803: length 2.2
  Top Layer w0.381: 37.14,22.01 39.09,22.01 39.29,22.21
$1N2932: length 4.8
  Top Layer w0.381: U1.13 26.6,21.67 25.94,22.33 C7.2
$1N2935: length 2.2
  Top Layer w0.381: R8.1 25.78,26.89 C7.1
$1N2952: length 9.8
  Top Layer w0.381: R9.1 30.26,26.25 C8.2 32.28,24.42 28.87,21.02 U1.12
$1N2960: length 11.7
  Top Layer w0.254: C9.2 34.39,26.2 R10.1
  Top Layer w0.381: 34.39,26.2 34.41,26.18 34.41,25.24 29.53,20.37 U1.11

## Copper pours and planes (outline as drawn; the poured copper is in the pictures)
GND on Top Layer: 0.11,42.93 49.56,42.93 50.48,42.02 50.48,0.9 49.41,-0.16 0.51,-0.16 -0.43,0.78 -0.43,42.19 0.11,42.74
GND on Bottom Layer: 0.01,42.43 49.46,42.43 50.38,41.51 50.38,0.4 49.32,-0.67 0.41,-0.67 -0.53,0.28 -0.53,41.69 0.01,42.23

## Text on the board
Top Silkscreen Layer: BandWidth(-3dB)：500MHz | CVS | ADJ | GND | PUL | GAIN | MODE | VCC | GAIN adj | ENBL | DETO | voltage crl / (0~1V) | Gain ctrl range:45dB(max gain42.5dB) | Sig IN | Sig OUT | [2025]AD8367 varible Gain OP
